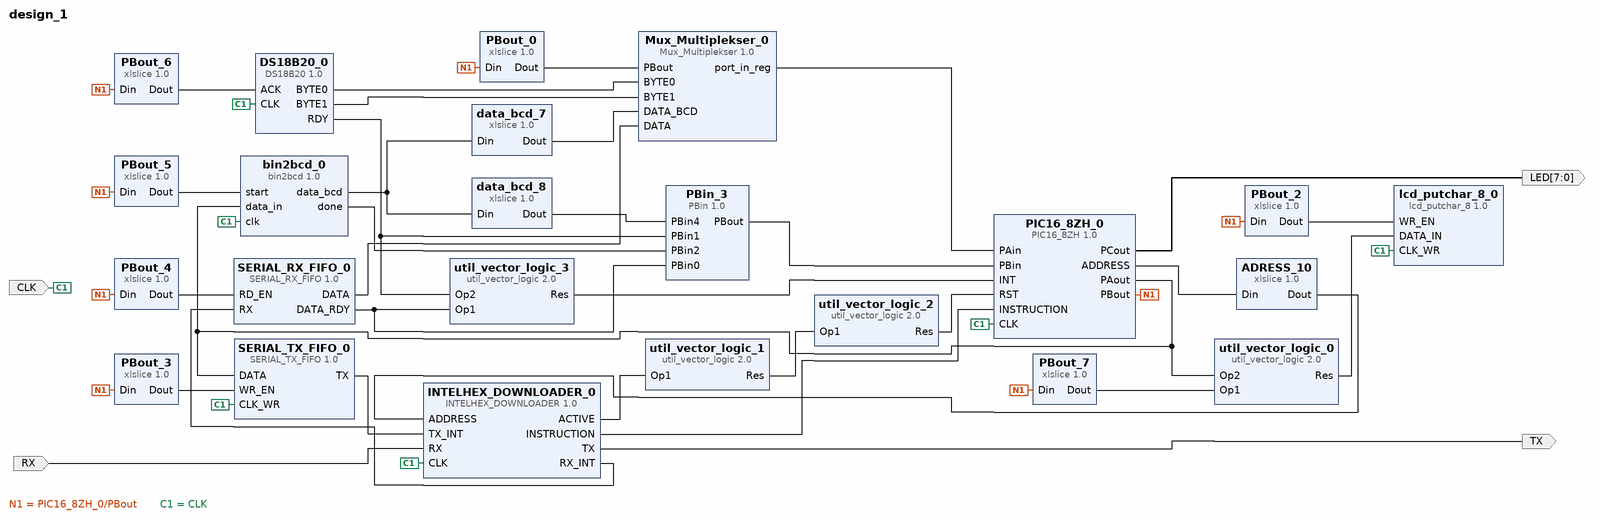
[diagram p0: block diagram of the top level]
# Vivado block design design_1, xc7z020clg400-2, Vivado 2019.1
create_bd_design design_1

create_bd_port -dir O -from 7 -to 0 LED
create_bd_port -dir O TX
create_bd_port -dir I RX
create_bd_port -dir I -type clk CLK

create_bd_cell -type ip -vlnv xilinx.com:user:PIC16_8ZH:1.0 PIC16_8ZH_0
create_bd_cell -type ip -vlnv xilinx.com:user:lcd_putchar_8:1.0 lcd_putchar_8_0
create_bd_cell -type ip -vlnv xilinx.com:user:SERIAL_TX_FIFO:1.0 SERIAL_TX_FIFO_0
create_bd_cell -type ip -vlnv xilinx.com:ip:xlslice:1.0 PBout_6
set_property -dict {CONFIG.DIN_FROM 6 CONFIG.DIN_TO 6 CONFIG.DIN_WIDTH 8 CONFIG.DOUT_WIDTH 1} [get_bd_cells PBout_6]
create_bd_cell -type ip -vlnv xilinx.com:ip:util_vector_logic:2.0 util_vector_logic_0
create_bd_cell -type ip -vlnv xilinx.com:ip:xlslice:1.0 PBout_2
set_property -dict {CONFIG.DIN_FROM 2 CONFIG.DIN_TO 2 CONFIG.DIN_WIDTH 8 CONFIG.DOUT_WIDTH 1} [get_bd_cells PBout_2]
create_bd_cell -type ip -vlnv xilinx.com:ip:xlslice:1.0 PBout_3
set_property -dict {CONFIG.DIN_FROM 3 CONFIG.DIN_TO 3 CONFIG.DIN_WIDTH 8 CONFIG.DOUT_WIDTH 1} [get_bd_cells PBout_3]
create_bd_cell -type ip -vlnv xilinx.com:ip:util_vector_logic:2.0 util_vector_logic_1
set_property -dict {CONFIG.C_OPERATION not} [get_bd_cells util_vector_logic_1]
create_bd_cell -type ip -vlnv xilinx.com:ip:xlslice:1.0 PBout_7
set_property -dict {CONFIG.DIN_FROM 7 CONFIG.DIN_TO 7 CONFIG.DIN_WIDTH 8 CONFIG.DOUT_WIDTH 1} [get_bd_cells PBout_7]
create_bd_cell -type ip -vlnv xilinx.com:ip:xlslice:1.0 PBout_4
set_property -dict {CONFIG.DIN_FROM 4 CONFIG.DIN_TO 4 CONFIG.DIN_WIDTH 8 CONFIG.DOUT_WIDTH 1} [get_bd_cells PBout_4]
create_bd_cell -type ip -vlnv xilinx.com:ip:xlslice:1.0 PBout_5
set_property -dict {CONFIG.DIN_FROM 5 CONFIG.DIN_TO 5 CONFIG.DIN_WIDTH 8 CONFIG.DOUT_WIDTH 1} [get_bd_cells PBout_5]
create_bd_cell -type ip -vlnv xilinx.com:ip:xlslice:1.0 ADRESS_10
set_property -dict {CONFIG.DIN_FROM 10 CONFIG.DIN_TO 0 CONFIG.DIN_WIDTH 13 CONFIG.DOUT_WIDTH 3} [get_bd_cells ADRESS_10]
create_bd_cell -type ip -vlnv xilinx.com:user:INTELHEX_DOWNLOADER:1.0 INTELHEX_DOWNLOADER_0
create_bd_cell -type ip -vlnv xilinx.com:user:bin2bcd:1.0 bin2bcd_0
create_bd_cell -type ip -vlnv xilinx.com:ip:util_vector_logic:2.0 util_vector_logic_2
set_property -dict {CONFIG.C_OPERATION and} [get_bd_cells util_vector_logic_2]
create_bd_cell -type ip -vlnv xilinx.com:user:DS18B20:1.0 DS18B20_0
create_bd_cell -type ip -vlnv xilinx.com:user:SERIAL_RX_FIFO:1.0 SERIAL_RX_FIFO_0
create_bd_cell -type ip -vlnv xilinx.com:ip:util_vector_logic:2.0 util_vector_logic_3
set_property -dict {CONFIG.C_OPERATION or} [get_bd_cells util_vector_logic_3]
create_bd_cell -type ip -vlnv xilinx.com:ip:xlslice:1.0 PBout_0
set_property -dict {CONFIG.DIN_FROM 1 CONFIG.DIN_TO 0 CONFIG.DIN_WIDTH 8 CONFIG.DOUT_WIDTH 2} [get_bd_cells PBout_0]
create_bd_cell -type ip -vlnv xilinx.com:ip:xlslice:1.0 data_bcd_7
set_property -dict {CONFIG.DIN_FROM 7 CONFIG.DIN_TO 0 CONFIG.DIN_WIDTH 12 CONFIG.DOUT_WIDTH 8} [get_bd_cells data_bcd_7]
create_bd_cell -type ip -vlnv xilinx.com:user:Mux_Multiplekser:1.0 Mux_Multiplekser_0
create_bd_cell -type ip -vlnv xilinx.com:user:PBin:1.0 PBin_3
create_bd_cell -type ip -vlnv xilinx.com:ip:xlslice:1.0 data_bcd_8
set_property -dict {CONFIG.DIN_FROM 11 CONFIG.DIN_TO 8 CONFIG.DIN_WIDTH 12 CONFIG.DOUT_WIDTH 4} [get_bd_cells data_bcd_8]

# ---- connections ----

connect_bd_net [get_bd_pins PIC16_8ZH_0/PCout] [get_bd_ports LED]
connect_bd_net [get_bd_pins util_vector_logic_0/Res] [get_bd_pins lcd_putchar_8_0/DATA_IN]
connect_bd_net [get_bd_pins PIC16_8ZH_0/PBout] \
  [get_bd_pins PBout_3/Din] [get_bd_pins PBout_2/Din] [get_bd_pins PBout_5/Din] [get_bd_pins PBout_6/Din] \
  [get_bd_pins PBout_7/Din] [get_bd_pins PBout_4/Din] [get_bd_pins PBout_0/Din]
connect_bd_net [get_bd_pins PBout_2/Dout] [get_bd_pins lcd_putchar_8_0/WR_EN]
connect_bd_net [get_bd_pins PBout_3/Dout] [get_bd_pins SERIAL_TX_FIFO_0/WR_EN]
connect_bd_net [get_bd_pins PBout_7/Dout] [get_bd_pins util_vector_logic_0/Op1]
connect_bd_net [get_bd_pins PIC16_8ZH_0/PAout] \
  [get_bd_pins util_vector_logic_0/Op2] [get_bd_pins SERIAL_TX_FIFO_0/DATA] [get_bd_pins bin2bcd_0/data_in]
connect_bd_net [get_bd_pins PIC16_8ZH_0/ADDRESS] [get_bd_pins ADRESS_10/Din]
connect_bd_net [get_bd_pins ADRESS_10/Dout] [get_bd_pins INTELHEX_DOWNLOADER_0/ADDRESS]
connect_bd_net [get_bd_pins SERIAL_TX_FIFO_0/TX] [get_bd_pins INTELHEX_DOWNLOADER_0/TX_INT]
connect_bd_net [get_bd_pins INTELHEX_DOWNLOADER_0/ACTIVE] [get_bd_pins util_vector_logic_1/Op1]
connect_bd_net [get_bd_pins util_vector_logic_1/Res] [get_bd_pins util_vector_logic_2/Op1]
connect_bd_net [get_bd_pins util_vector_logic_2/Res] [get_bd_pins PIC16_8ZH_0/RST]
connect_bd_net [get_bd_pins INTELHEX_DOWNLOADER_0/TX] [get_bd_ports TX]
connect_bd_net -net RX_0_1 [get_bd_ports RX] [get_bd_pins INTELHEX_DOWNLOADER_0/RX]
connect_bd_net [get_bd_pins INTELHEX_DOWNLOADER_0/RX_INT] [get_bd_pins SERIAL_RX_FIFO_0/RX]
connect_bd_net [get_bd_pins INTELHEX_DOWNLOADER_0/INSTRUCTION] [get_bd_pins PIC16_8ZH_0/INSTRUCTION]
connect_bd_net [get_bd_pins util_vector_logic_3/Res] [get_bd_pins PIC16_8ZH_0/INT]
connect_bd_net [get_bd_pins PBout_6/Dout] [get_bd_pins DS18B20_0/ACK]
connect_bd_net [get_bd_pins PBout_5/Dout] [get_bd_pins bin2bcd_0/start]
connect_bd_net [get_bd_pins PBout_4/Dout] [get_bd_pins SERIAL_RX_FIFO_0/RD_EN]
connect_bd_net [get_bd_pins SERIAL_RX_FIFO_0/DATA_RDY] [get_bd_pins util_vector_logic_3/Op1] [get_bd_pins PBin_3/PBin0]
connect_bd_net [get_bd_pins DS18B20_0/RDY] [get_bd_pins util_vector_logic_3/Op2] [get_bd_pins PBin_3/PBin1]
connect_bd_net [get_bd_pins DS18B20_0/BYTE0] [get_bd_pins Mux_Multiplekser_0/BYTE0]
connect_bd_net [get_bd_pins DS18B20_0/BYTE1] [get_bd_pins Mux_Multiplekser_0/BYTE1]
connect_bd_net [get_bd_pins SERIAL_RX_FIFO_0/DATA] [get_bd_pins Mux_Multiplekser_0/DATA]
connect_bd_net [get_bd_pins data_bcd_7/Dout] [get_bd_pins Mux_Multiplekser_0/DATA_BCD]
connect_bd_net [get_bd_pins PBout_0/Dout] [get_bd_pins Mux_Multiplekser_0/PBout]
connect_bd_net [get_bd_pins Mux_Multiplekser_0/port_in_reg] [get_bd_pins PIC16_8ZH_0/PAin]
connect_bd_net [get_bd_pins PBin_3/PBout] [get_bd_pins PIC16_8ZH_0/PBin]
connect_bd_net [get_bd_pins bin2bcd_0/done] [get_bd_pins PBin_3/PBin2]
connect_bd_net [get_bd_pins bin2bcd_0/data_bcd] [get_bd_pins data_bcd_7/Din] [get_bd_pins data_bcd_8/Din]
connect_bd_net [get_bd_pins data_bcd_8/Dout] [get_bd_pins PBin_3/PBin4]
connect_bd_net -net CLK_0_1 [get_bd_ports CLK] \
  [get_bd_pins INTELHEX_DOWNLOADER_0/CLK] [get_bd_pins bin2bcd_0/clk] [get_bd_pins DS18B20_0/CLK] \
  [get_bd_pins PIC16_8ZH_0/CLK] [get_bd_pins SERIAL_TX_FIFO_0/CLK_WR] [get_bd_pins lcd_putchar_8_0/CLK_WR]

validate_bd_design
save_bd_design
